# Altium project PCB_Project1.PrjPCB
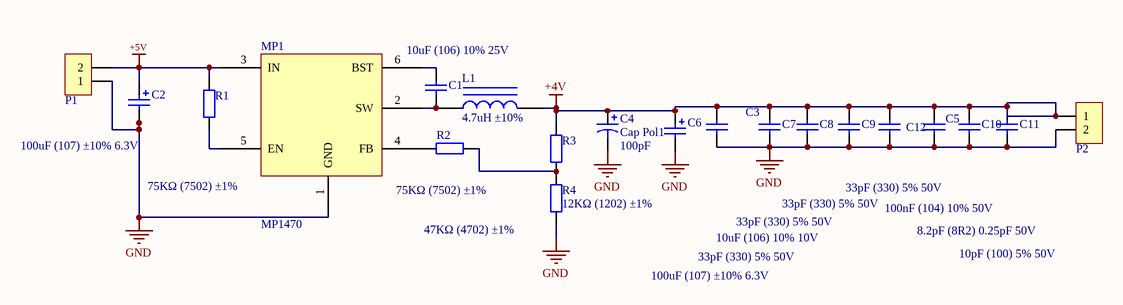
[diagram p0: 5v_4v.SchDoc]
1 sheet, 20 parts. Net scope: global (net labels, ports and power ports of the same name join across sheets).
Board file: 5v_4V.PcbDoc

## Sheet 5v_4v.SchDoc
size A

### Parts
C1  10uF (106) 10% 25V  [0805_C]
C2  100uF (107) ±10% 6.3V  [CASE-B_3528]
C3  10uF (106) 10% 10V  [0603_C]
C4  Cap Pol1  value 100pF  [C7361]
C5  100nF (104) 10% 50V  [0603_C]
C6  100uF (107) ±10% 6.3V  [CASE-B_3528]
C7  33pF (330) 5% 50V  [0603_C]
C8  33pF (330) 5% 50V  [0603_C]
C9  33pF (330) 5% 50V  [0603_C]
C10  8.2pF (8R2) 0.25pF 50V  [0603_C]
C11  10pF (100) 5% 50V  [0603_C]
C12  33pF (330) 5% 50V  [0603_C]
L1  4.7uH ±10%  [C8X10]
MP1  MP1470  [SOT-23-6M]
P1  HDR-1X2  [XH2.54-2]  (value not drawn)
P2  HDR-1X2  [XH2.54-2]  (value not drawn)
R1  75KΩ (7502) ±1%  [0603_R]
R2  75KΩ (7502) ±1%  [0603_R]
R3  47KΩ (4702) ±1%  [0603_R]
R4  12KΩ (1202) ±1%  [0603_R]

### Nets
+4V: C3.1 C4.1 C5.2 C6.1 C7.2 C8.2 C9.2 C10.2 C11.2 C12.2 L1.2 P2.1 R3.2
+5V: C2.1 MP1.3(IN) P1.2 R1.2
GND: C2.2 C3.2 C4.2 C5.1 C6.2 C7.1 C8.1 C9.1 C10.1 C11.1 C12.1 MP1.1(GND) P1.1 P2.2 R4.1
NetC1_1: C1.1 L1.1 MP1.2(SW)
NetC1_2: C1.2 MP1.6(BST)
NetMP1_4: MP1.4(FB) R2.1
NetMP1_5: MP1.5(EN) R1.1
NetR2_2: R2.2 R3.1 R4.2

### Library data of the parts
C1 = 0805 10uF (106) 10% 25V: 贴片电容; ComponentLink1Description: 供应商链接; ComponentLink1URL: http://www.szlcsc.com/product/details_16532.html; Package: 0805; Supplier: LC; SuppliersPartNumber: C15850
C2 C6 = 3528 100uF (107) 10% 6.3V: 钽电容; ComponentLink1Description: 供应商链接; ComponentLink1URL: http://www.szlcsc.com/product/details_16815.html; Package: 3528; Supplier: LC; SuppliersPartNumber: C16133
C3 = 0603 10uF (106) 10% 10V: 贴片电容; ComponentLink1Description: 供应商链接; ComponentLink1URL: http://www.szlcsc.com/product/details_20411.html; Package: 0603; Supplier: LC; SuppliersPartNumber: C19702
C4 = Cap Pol1: Polarized Capacitor (Radial); Published: 8-Jun-2000; LatestRevisionDate: 17-Jul-2002; LatestRevisionNote: Re-released for DXP Platform.; PackageReference: RB7.6-15; Publisher: Altium Limited; PackageDescription: Polarized Capacitor (Radial); 2 Leads
C5 = 0603 100nF (104) 10% 50V: 贴片电容; ComponentLink1Description: 供应商链接; ComponentLink1URL: http://www.szlcsc.com/product/details_15331.html; Package: 0603; Supplier: LC; SuppliersPartNumber: C14663
C7-C9 C12 = 0603 33pF (330) 5% 50V: 贴片电容; ComponentLink1Description: 供应商链接; ComponentLink1URL: http://www.szlcsc.com/product/details_2015.html; Package: 0603; Supplier: LC; SuppliersPartNumber: C1663
C10 = 0603 8.2pF (8R2) 0.25pF 50V: 贴片电容; ComponentLink1Description: 供应商链接; ComponentLink1URL: http://www.szlcsc.com/product/details_2037.html; Package: 0603; Supplier: LC; SuppliersPartNumber: C1685
C11 = 0603 10pF (100) 5% 50V: 贴片电容; ComponentLink1Description: 供应商链接; ComponentLink1URL: http://www.szlcsc.com/product/details_1986.html; Package: 0603; Supplier: LC; SuppliersPartNumber: C1634
L1 = 0603 4.7uH 10%: 贴片电感; ComponentLink1Description: 供应商链接; ComponentLink1URL: http://www.szlcsc.com/product/details_1386.html; Package: 0603; Supplier: LC; SuppliersPartNumber: C1034
P1 P2 = Header 2: 2P接插件; 版权归属: 源创客; BOM名称: 2P接插件; 学习资源: www.ooocke.com
R1 R2 = 0603 75KΩ (7502) 1%: 贴片电阻; ComponentLink1Description: 供应商链接; ComponentLink1URL: http://www.szlcsc.com/product/details_23969.html; Package: 0603; Supplier: LC; SuppliersPartNumber: C23242
R3 = 0603 47KΩ (4702) 1%: 贴片电阻; ComponentLink1Description: 供应商链接; ComponentLink1URL: http://www.szlcsc.com/product/details_26562.html; Package: 0603; Supplier: LC; SuppliersPartNumber: C25819
R4 = 0603 12KΩ (1202) 1%: 贴片电阻; ComponentLink1Description: 供应商链接; ComponentLink1URL: http://www.szlcsc.com/product/details_23517.html; Package: 0603; Supplier: LC; SuppliersPartNumber: C22790